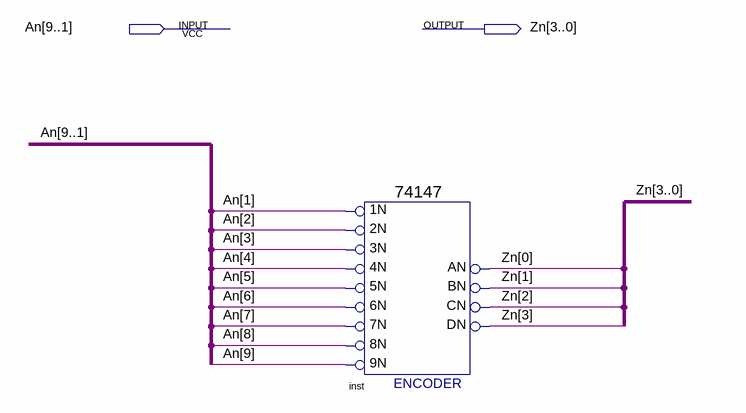
[diagram p0: schematic sheet]
// Quartus schematic ttl74147.bdf as structural Verilog: 1 symbols, 2 pins
module ttl74147 (
  input  [9:1] An,
  output [3:0] Zn
);

  \74147  inst (
    .\1N (An[1]), .\2N (An[2]), .\3N (An[3]), .\6N (An[6]), .\5N (An[5]), .\4N (An[4]), .\9N (An[9]),
    .\8N (An[8]), .\7N (An[7]), .CN(Zn[2]), .BN(Zn[1]), .AN(Zn[0]), .DN(Zn[3]));
endmodule
